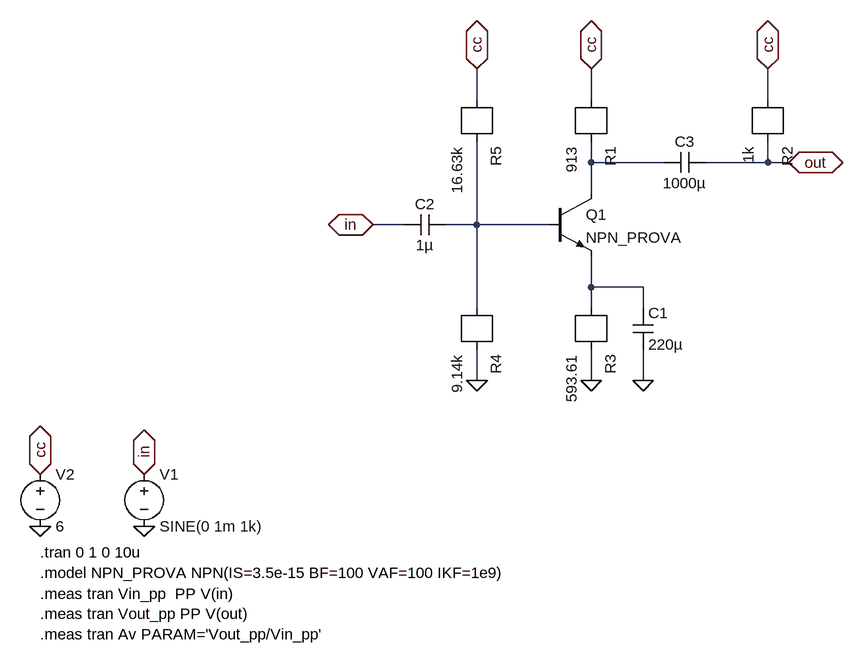
[diagram p0: schematic circuit_lt.asc]
circuit_lt.asc, the LTspice schematic file:
Version 4
SHEET 1 1268 696
WIRE 704 -192 704 -240
WIRE 880 -192 880 -240
WIRE 1152 -192 1152 -240
WIRE 880 -96 880 -128
WIRE 992 -96 880 -96
WIRE 1152 -96 1152 -128
WIRE 1152 -96 1056 -96
WIRE 1184 -96 1152 -96
WIRE 880 -48 880 -96
WIRE 592 0 544 0
WIRE 704 0 704 -128
WIRE 704 0 656 0
WIRE 816 0 704 0
WIRE 880 96 880 48
WIRE 960 96 880 96
WIRE 704 128 704 0
WIRE 880 128 880 96
WIRE 960 128 960 96
WIRE 704 240 704 192
WIRE 880 240 880 192
WIRE 960 240 960 192
FLAG 32 464 0
FLAG 192 464 0
FLAG 32 384 cc
IOPIN 32 384 BiDir
FLAG 192 384 in
IOPIN 192 384 BiDir
FLAG 544 0 in
IOPIN 544 0 BiDir
FLAG 880 240 0
FLAG 704 240 0
FLAG 704 -240 cc
IOPIN 704 -240 BiDir
FLAG 880 -240 cc
IOPIN 880 -240 BiDir
FLAG 960 240 0
FLAG 1184 -96 out
IOPIN 1184 -96 BiDir
FLAG 1152 -240 cc
IOPIN 1152 -240 BiDir
SYMBOL voltage 192 368 R0
SYMATTR InstName V1
SYMATTR Value SINE(0 1m 1k)
SYMBOL voltage 32 368 R0
SYMATTR InstName V2
SYMATTR Value 6
SYMBOL npn 816 -48 R0
SYMATTR InstName Q1
SYMATTR Value NPN_PROVA
SYMBOL r 880 -192 R90
SYMATTR InstName R1
SYMATTR Value 913
SYMBOL r 1152 -192 R90
SYMATTR InstName R2
SYMATTR Value 1k
SYMBOL r 880 128 R90
SYMATTR InstName R3
SYMATTR Value 593.61
SYMBOL r 704 128 R90
SYMATTR InstName R4
SYMATTR Value 9.14k
SYMBOL r 704 -192 R90
SYMATTR InstName R5
SYMATTR Value 16.63k
SYMBOL cap 944 128 R0
SYMATTR InstName C1
SYMATTR Value 220µ
SYMBOL cap 656 -16 R90
WINDOW 0 0 32 VBottom 2
WINDOW 3 32 32 VTop 2
SYMATTR InstName C2
SYMATTR Value 1µ
SYMBOL cap 1056 -112 R90
WINDOW 0 0 32 VBottom 2
WINDOW 3 32 32 VTop 2
SYMATTR InstName C3
SYMATTR Value 1000µ
TEXT 32 536 Left 2 !.model NPN_PROVA NPN(IS=3.5e-15 BF=100 VAF=100 IKF=1e9)
TEXT 32 504 Left 2 !.tran 0 1 0 10u
TEXT 32 568 Left 2 !.meas tran Vin_pp  PP V(in)\n.meas tran Vout_pp PP V(out)\n.meas tran Av PARAM='Vout_pp/Vin_pp'

The netlist it stands for:
* circuit_lt.asc
V1 in 0 SINE(0 1m 1k)
V2 cc 0 6
Q1 N001 N002 N003 0 NPN_PROVA
R1 N001 cc 913
R2 out cc 1k
R3 0 N003 593.61
R4 0 N002 9.14k
R5 N002 cc 16.63k
C1 N003 0 220µ
C2 N002 in 1µ
C3 out N001 1000µ
.model NPN NPN
.model PNP PNP
.lib standard.bjt
.model NPN_PROVA NPN(IS=3.5e-15 BF=100 VAF=100 IKF=1e9)
.tran 0 1 0 10u
.meas tran Vin_pp  PP V(in)
.meas tran Vout_pp PP V(out)
.meas tran Av PARAM='Vout_pp/Vin_pp'
.backanno
.end